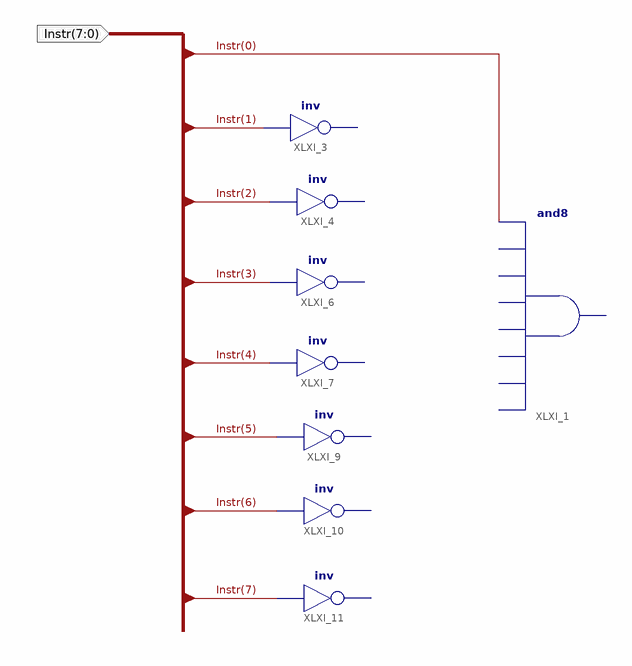
[diagram p0: schematic sheet 1]
// Xilinx ISE schematic instrDecode.sch (spartan3e) as structural Verilog: 8 symbols, 1 ports
module instrDecode (
  input  [7:0] Instr
);

  // and8 XLXI_1 has open pins: I0=open, I1=open, I2=open, I3=open, I4=open, I5=open, I6=open, I7=Instr[0], O=open
  // inv XLXI_3 has open pins: I=Instr[1], O=open
  // inv XLXI_4 has open pins: I=Instr[2], O=open
  // inv XLXI_6 has open pins: I=Instr[3], O=open
  // inv XLXI_7 has open pins: I=Instr[4], O=open
  // inv XLXI_9 has open pins: I=Instr[5], O=open
  // inv XLXI_10 has open pins: I=Instr[6], O=open
  // inv XLXI_11 has open pins: I=Instr[7], O=open
endmodule
